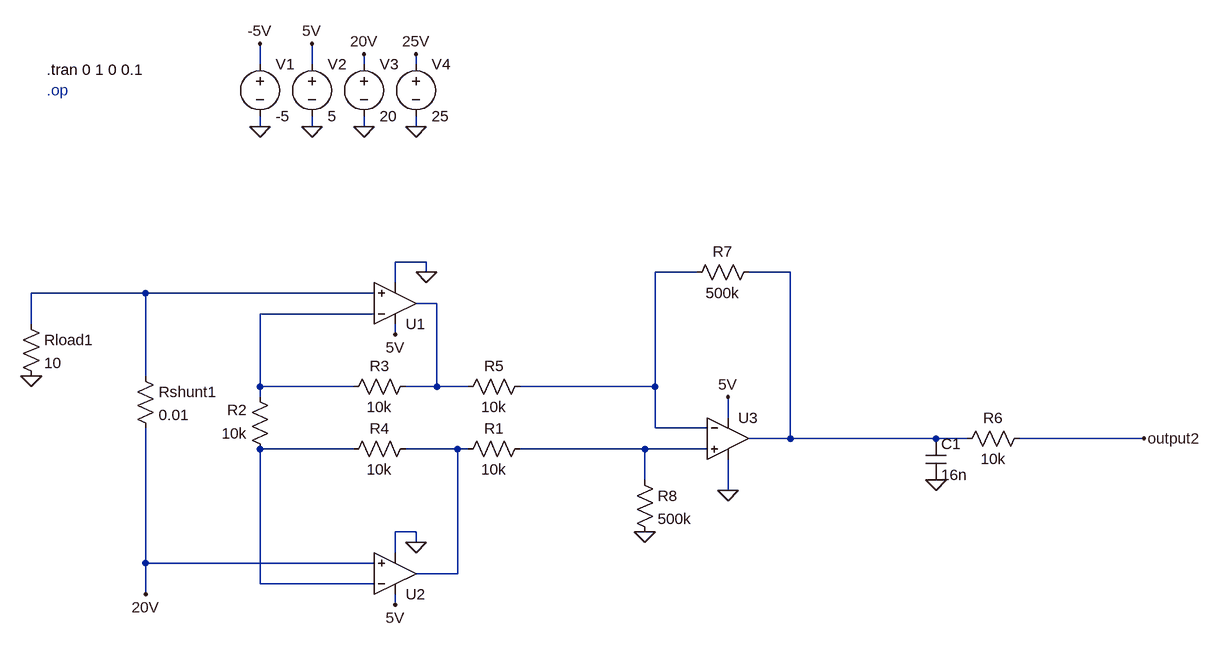
[diagram p0: schematic generics (test).asc]
generics (test).asc, the LTspice schematic file:
Version 4.1
SHEET 1 1228 680
WIRE -240 -384 -240 -416
WIRE -160 -384 -160 -416
WIRE -80 -384 -80 -400
WIRE 0 -384 0 -400
WIRE -240 -288 -240 -304
WIRE -160 -288 -160 -304
WIRE -80 -288 -80 -304
WIRE 0 -288 0 -304
WIRE 16 -80 -32 -80
WIRE 16 -64 16 -80
WIRE 432 -64 368 -64
WIRE 576 -64 512 -64
WIRE -32 -48 -32 -80
WIRE -416 -32 -592 -32
WIRE -64 -32 -416 -32
WIRE 32 -16 0 -16
WIRE -64 0 -240 0
WIRE -592 16 -592 -32
WIRE -32 32 -32 16
WIRE -416 96 -416 -32
WIRE -240 112 -240 0
WIRE -96 112 -240 112
WIRE 32 112 32 -16
WIRE 32 112 -16 112
WIRE 80 112 32 112
WIRE 368 112 368 -64
WIRE 368 112 160 112
WIRE -240 128 -240 112
WIRE 480 160 480 128
WIRE 368 176 368 112
WIRE 448 176 368 176
WIRE 576 192 576 -64
WIRE 576 192 512 192
WIRE 800 192 576 192
WIRE 848 192 800 192
WIRE 1120 192 928 192
WIRE -96 208 -240 208
WIRE 64 208 -16 208
WIRE 80 208 64 208
WIRE 352 208 160 208
WIRE 448 208 352 208
WIRE 352 256 352 208
WIRE 480 272 480 224
WIRE 0 336 -32 336
WIRE 0 352 0 336
WIRE -32 368 -32 336
WIRE -416 384 -416 176
WIRE -64 384 -416 384
WIRE 64 400 64 208
WIRE 64 400 0 400
WIRE -240 416 -240 208
WIRE -64 416 -240 416
WIRE -416 432 -416 384
WIRE -32 448 -32 432
FLAG -32 32 5V
FLAG -416 432 20V
FLAG -592 96 0
FLAG 1120 192 output2
FLAG 800 256 0
FLAG 352 336 0
FLAG -32 448 5V
FLAG 480 128 5V
FLAG 0 352 0
FLAG 480 272 0
FLAG 16 -64 0
FLAG -160 -416 5V
FLAG -240 -416 -5V
FLAG -240 -288 0
FLAG -160 -288 0
FLAG -80 -400 20V
FLAG -80 -288 0
FLAG 0 -288 0
FLAG 0 -400 25V
DATAFLAG -320 384 ""
DATAFLAG -384 -32 ""
DATAFLAG 272 112 ""
DATAFLAG 256 208 ""
DATAFLAG 1040 192 ""
DATAFLAG 16 -16 ""
DATAFLAG 32 400 ""
SYMBOL res 176 192 R90
WINDOW 0 0 56 VBottom 2
WINDOW 3 32 56 VTop 2
SYMATTR InstName R1
SYMATTR Value 10k
SYMBOL res -224 224 R180
WINDOW 0 36 76 Left 2
WINDOW 3 36 40 Left 2
SYMATTR InstName R2
SYMATTR Value 10k
SYMBOL res -112 128 R270
WINDOW 0 32 56 VTop 2
WINDOW 3 0 56 VBottom 2
SYMATTR InstName R3
SYMATTR Value 10k
SYMBOL res -112 224 R270
WINDOW 0 32 56 VTop 2
WINDOW 3 0 56 VBottom 2
SYMATTR InstName R4
SYMATTR Value 10k
SYMBOL res 176 96 R90
WINDOW 0 0 56 VBottom 2
WINDOW 3 32 56 VTop 2
SYMATTR InstName R5
SYMATTR Value 10k
SYMBOL res -432 80 R0
SYMATTR InstName Rshunt1
SYMATTR Value 0.01
SYMBOL res -608 0 R0
SYMATTR InstName Rload1
SYMATTR Value 10
SYMBOL res 944 176 R90
WINDOW 0 0 56 VBottom 2
WINDOW 3 32 56 VTop 2
SYMATTR InstName R6
SYMATTR Value 10k
SYMBOL cap 784 192 R0
SYMATTR InstName C1
SYMATTR Value 16n
SYMBOL res 528 -80 R90
WINDOW 0 0 56 VBottom 2
WINDOW 3 32 56 VTop 2
SYMATTR InstName R7
SYMATTR Value 500k
SYMBOL res 336 240 R0
SYMATTR InstName R8
SYMATTR Value 500k
SYMBOL OpAmps\\UniversalOpAmp -32 -16 M180
SYMATTR InstName U1
SYMBOL OpAmps\\UniversalOpAmp -32 400 M180
SYMATTR InstName U2
SYMBOL OpAmps\\UniversalOpAmp 480 192 R0
SYMATTR InstName U3
SYMBOL voltage -240 -400 R0
WINDOW 123 0 0 Left 0
WINDOW 39 0 0 Left 0
SYMATTR InstName V1
SYMATTR Value -5
SYMBOL voltage -160 -400 R0
WINDOW 123 0 0 Left 0
WINDOW 39 0 0 Left 0
SYMATTR InstName V2
SYMATTR Value 5
SYMBOL voltage -80 -400 R0
WINDOW 123 0 0 Left 0
WINDOW 39 0 0 Left 0
SYMATTR InstName V3
SYMATTR Value 20
SYMBOL voltage 0 -400 R0
WINDOW 123 0 0 Left 0
WINDOW 39 0 0 Left 0
SYMATTR InstName V4
SYMATTR Value 25
TEXT -568 -376 Left 2 !.tran 0 1 0 0.1
TEXT -568 -344 Left 2 ;.op

The netlist it stands for:
* generics (test).asc
R1 N008 N007 10k
R2 N006 N005 10k
R3 N005 N004 10k
R4 N006 N007 10k
R5 N001 N004 10k
Rshunt1 N003 20V 0.01
Rload1 N003 0 10
R6 output2 N002 10k
C1 N002 0 16n
R7 N002 N001 500k
R8 N008 0 500k
X§U1 N003 N005 5V 0 N004 level1 Avol=1Meg GBW=10Meg Vos=0 En=0 Enk=0 In=0 Ink=0 Rin=500Meg  ; pins In+ In- V+ V- OUT
X§U2 20V N006 5V 0 N007 level1 Avol=1Meg GBW=10Meg Vos=0 En=0 Enk=0 In=0 Ink=0 Rin=500Meg  ; pins In+ In- V+ V- OUT
X§U3 N008 N001 5V 0 N002 level1 Avol=1Meg GBW=10Meg Vos=0 En=0 Enk=0 In=0 Ink=0 Rin=500Meg  ; pins In+ In- V+ V- OUT
V1 -5V 0 -5
V2 5V 0 5
V3 20V 0 20
V4 25V 0 25
.tran 0 1 0 0.1
* .op
.lib UniversalOpAmp1.lib
.backanno
.end